# EAGLE design GenericCommand (EAGLE 9.3.0)
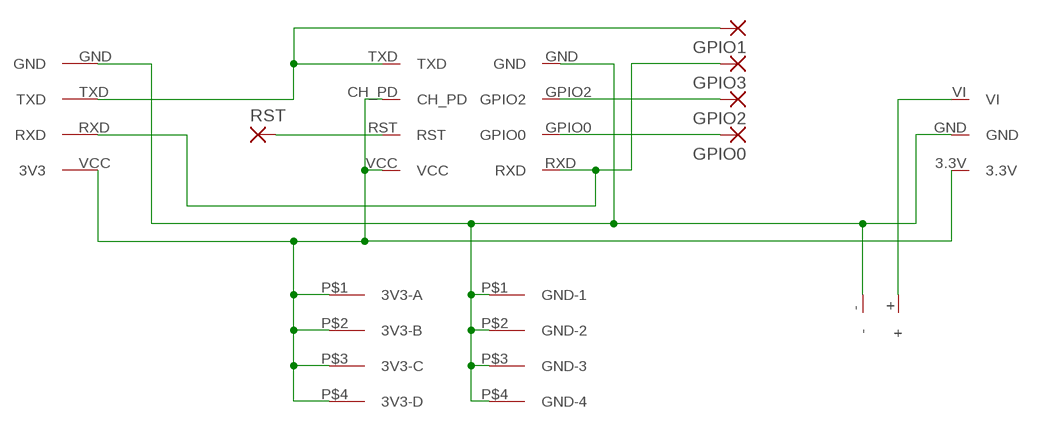
[diagram p0: schematic, sheet 1]

## Parts
GPIO0  1,6/0,9  [1,6/0,9]
GPIO1  1,6/0,9  [1,6/0,9]
GPIO2  1,6/0,9  [1,6/0,9]
GPIO3  1,6/0,9  [1,6/0,9]
RST  1,6/0,9  [1,6/0,9]
U$1  LOW_POWER  [LOW_POWER]
U$2  3.3V-REG-SLOT  [3.3V-REG-SLOT]
U$3  ESP-01-SLOT  [ESP-01-SLOT]
U$4  CP-2102-CONN  [CP-2102-CONN]
U$5  3V3-4  [3.3V-4]
U$6  GND-4  [GND-4]

## Nets
N$1 [power]: U$2.3.3V U$3.CH_PD U$3.VCC U$4.VCC(3V3) U$5.P$1(3V3-A) U$5.P$2(3V3-B) U$5.P$3(3V3-C) U$5.P$4(3V3-D)
N$2 [power]: U$1.- U$2.GND U$3.GND U$4.GND U$6.P$1(GND-1) U$6.P$2(GND-2) U$6.P$3(GND-3) U$6.P$4(GND-4)
N$3 [power]: U$1.+ U$2.VI
N$4: GPIO0.1(P) U$3.GPIO0
N$5: GPIO2.1(P) U$3.GPIO2
N$6: RST.1(P) U$3.RST
N$7: GPIO3.1(P) U$3.RXD U$4.RXD
N$8: GPIO1.1(P) U$3.TXD U$4.TXD

## Library data of the parts
GPIO0 GPIO1-GPIO3 RST = wirepad:1,6/0,9: THROUGH-HOLE PAD
U$1 = home-mind:LOW_POWER
U$2 = home-mind:3.3V-REG-SLOT
U$3 = home-mind:ESP-01-SLOT
U$4 = home-mind:CP-2102-CONN
U$5 = home-mind:3V3-4
U$6 = home-mind:GND-4

## Net classes
0 default: width 0.3 mm, drill 0.3 mm, clearance 0.3 mm
1 power: width 1.2 mm, drill 0.5 mm, clearance 0.5 mm

## Board
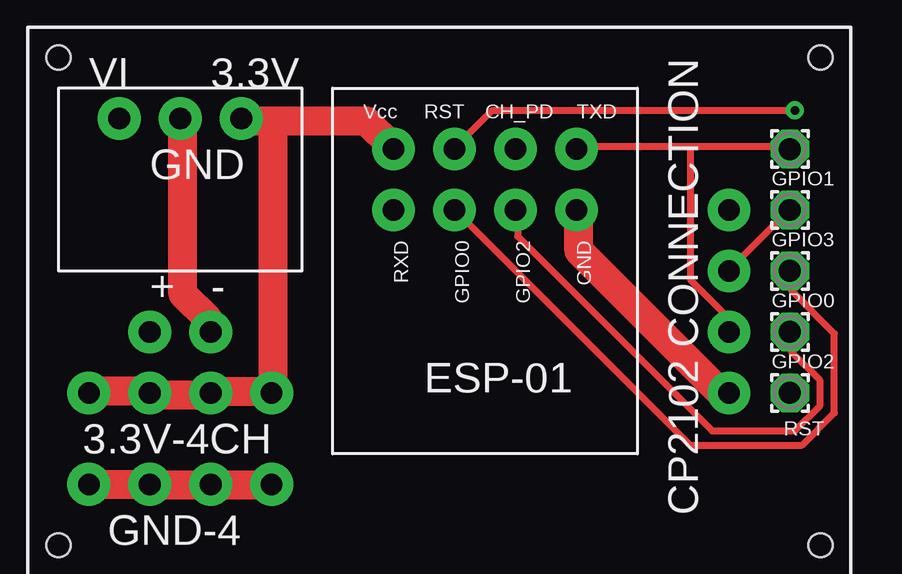
[diagram p1: board, top side]
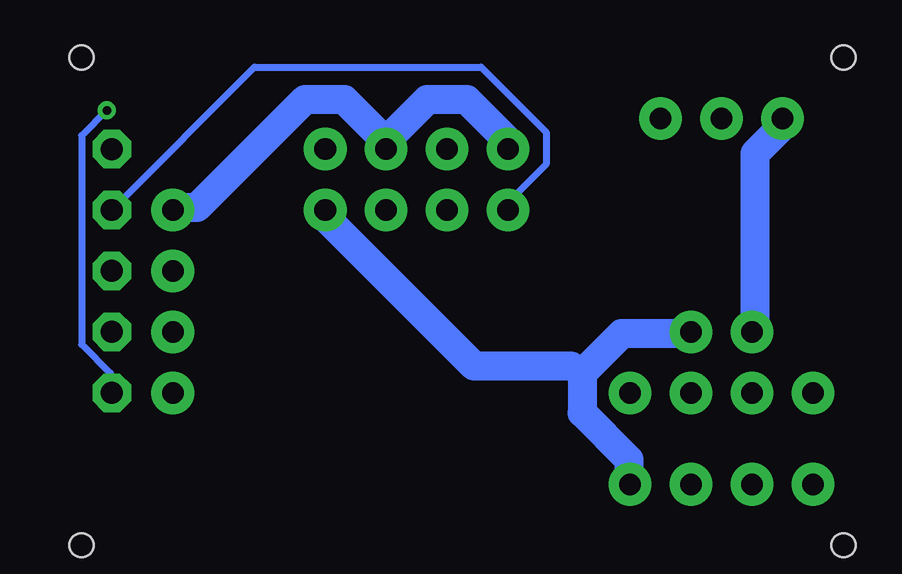
[diagram p2: board, bottom side, seen from below]

No outline drawn. Coordinates in mm, seen from the top.
Copper layers (1*16): Top 0.035mm / dielectric 1.5mm / Bottom 0.035mm
Design rules "default": minimum track width 6mil, minimum drill 0.35mm, track to track 6mil, track to pad 6mil, pad to pad 6mil, via to via 6mil, smd to smd 6mil, copper to edge 40mil, drill to drill 6mil, minimum pad ring 10mil, minimum via ring 8mil, stop-mask expansion 4mil, vias tented up to drill 0mil, thermal gap 10mil
Holes 1 mm at -15.24,12.7 16.51,12.7 16.51,-7.62 -15.24,-7.62

### Footprints (pad centres in the part's own frame; a part is rotated, then mirrored left to right if it is on the bottom)
1,6/0,9 = drill 0.914 pad 1.6 octagon: 1 0,0
LOW_POWER = drill 0.9 pad 1.778: + -1.27,0; - 1.27,0
3.3V-REG-SLOT = drill 0.9 pad 1.778: 3.3V 2.54,0; GND 0,0; VI -2.54,0
ESP-01-SLOT = drill 0.9 pad 1.778: CH_PD 1.27,1.27; GND 3.81,-1.27; GPIO0 -1.27,-1.27; GPIO2 1.27,-1.27; RST -1.27,1.27; RXD -3.81,-1.27; TXD 3.81,1.27; VCC -3.81,1.27
CP-2102-CONN = drill 0.9 pad 1.778: GND 0,-3.81; RXD 0,1.27; TXD 0,-1.27; VCC 0,3.81
3.3V-4 = drill 0.9 pad 1.778: P$1 0,0; P$2 2.54,0; P$3 5.08,0; P$4 7.62,0
GND-4 = drill 0.9 pad 1.778: P$1 0,0; P$2 2.54,0; P$3 5.08,0; P$4 7.62,0

### Placement (x,y rotation side)
GPIO0  15.24,3.81 0 top
GPIO1  15.24,8.89 0 top
GPIO2  15.24,1.27 0 top
GPIO3  15.24,6.35 0 top
RST  15.24,-1.27 270 top
U$1  -10.16,1.27 0 top
U$2  -10.16,10.16 0 top
U$3  2.54,7.62 0 top
U$4  12.7,2.54 0 top
U$5  -6.35,-1.27 180 top
U$6  -6.35,-5.08 180 top

### Tracks (layer width: path | path; a pad name or v marks a point on that pad's centre or on a via)
N$1
  Top 1.2: U$5.P$4 -13.95,-1.2 -11.55,-1.2 U$5.P$3 -10.8,-1.35 -9,-1.35 U$5.P$2 -8.4,-1.2 -6.45,-1.2 U$5.P$1 -6.3,-0.6 -6.3,10.05 | -6.3,10.05 -2.4,10.05 -1.35,9 U$3.VCC | -6.3,10.05 -7.5,10.05 U$2.3.3V
  Bottom 1.2: U$3.VCC -1.2,9 -1.2,9.3 0.45,10.95 2.1,10.95 3.75,9.3 3.75,9 U$3.CH_PD 4.2,9.6 5.55,10.95 7.2,10.95 11.7,6.45 12.6,6.45 U$4.VCC
N$2
  Top 1.2: U$3.GND 6.45,6.3 6.45,4.65 12.3,-1.2 12.6,-1.2 U$4.GND | U$6.P$4 -13.95,-5.1 -11.55,-5.1 U$6.P$3 -10.95,-5.1 -9,-5.1 U$6.P$2 -8.4,-5.1 -6.45,-5.1 U$6.P$1 | U$2.GND -10.05,10.05 -10.05,2.85 -9,1.8 -9,1.35 U$1.-
  Bottom 1.2: -4.35,-0.45 -4.35,-2.1 -6.3,-4.05 -6.3,-4.95 U$6.P$1 | -4.35,-0.45 -6,1.2 -8.85,1.2 U$1.- | U$3.GND 6.3,6.3 6.3,6 0.15,-0.15 -3.9,-0.15 -4.35,-0.45
N$3
  Bottom 1.2: U$1.+ -11.55,1.35 -11.55,8.7 -12.6,9.75 -12.6,10.05 U$2.VI
N$4
  Top 0.3: GPIO0.1 15.3,3.75 15.3,3 17.1,1.2 17.1,-2.1 15.75,-3.45 11.1,-3.45 1.35,6.3 U$3.GPIO0
N$5
  Top 0.3: GPIO2.1 15.3,1.2 15.3,0.45 16.5,-0.75 16.5,-1.8 15.45,-2.85 12,-2.85 3.9,5.25 3.9,6.3 U$3.GPIO2
N$6  (via drill 0.35)
  Top 0.3: v15.45,10.5 2.85,10.5 1.35,9 U$3.RST
  Bottom 0.3: v15.45,10.5 16.5,9.45 16.5,0.75 15.3,-0.45 15.3,-1.2 RST.1
N$7
  Top 0.3: GPIO3.1 15.15,6.3 12.75,3.9 U$4.RXD
  Bottom 0.3: U$3.RXD -1.35,6.45 -1.35,6.75 -2.85,8.25 -2.85,9.6 -0.15,12.3 9.3,12.3 15.15,6.45 GPIO3.1
N$8
  Top 0.3: 11.1,9 6.45,9 U$3.TXD | 11.1,9 15.15,9 GPIO1.1 | 11.1,9 11.1,3.45 12.6,1.95 12.6,1.35 U$4.TXD